# EAGLE design rat17-18 (EAGLE 8.3.2)
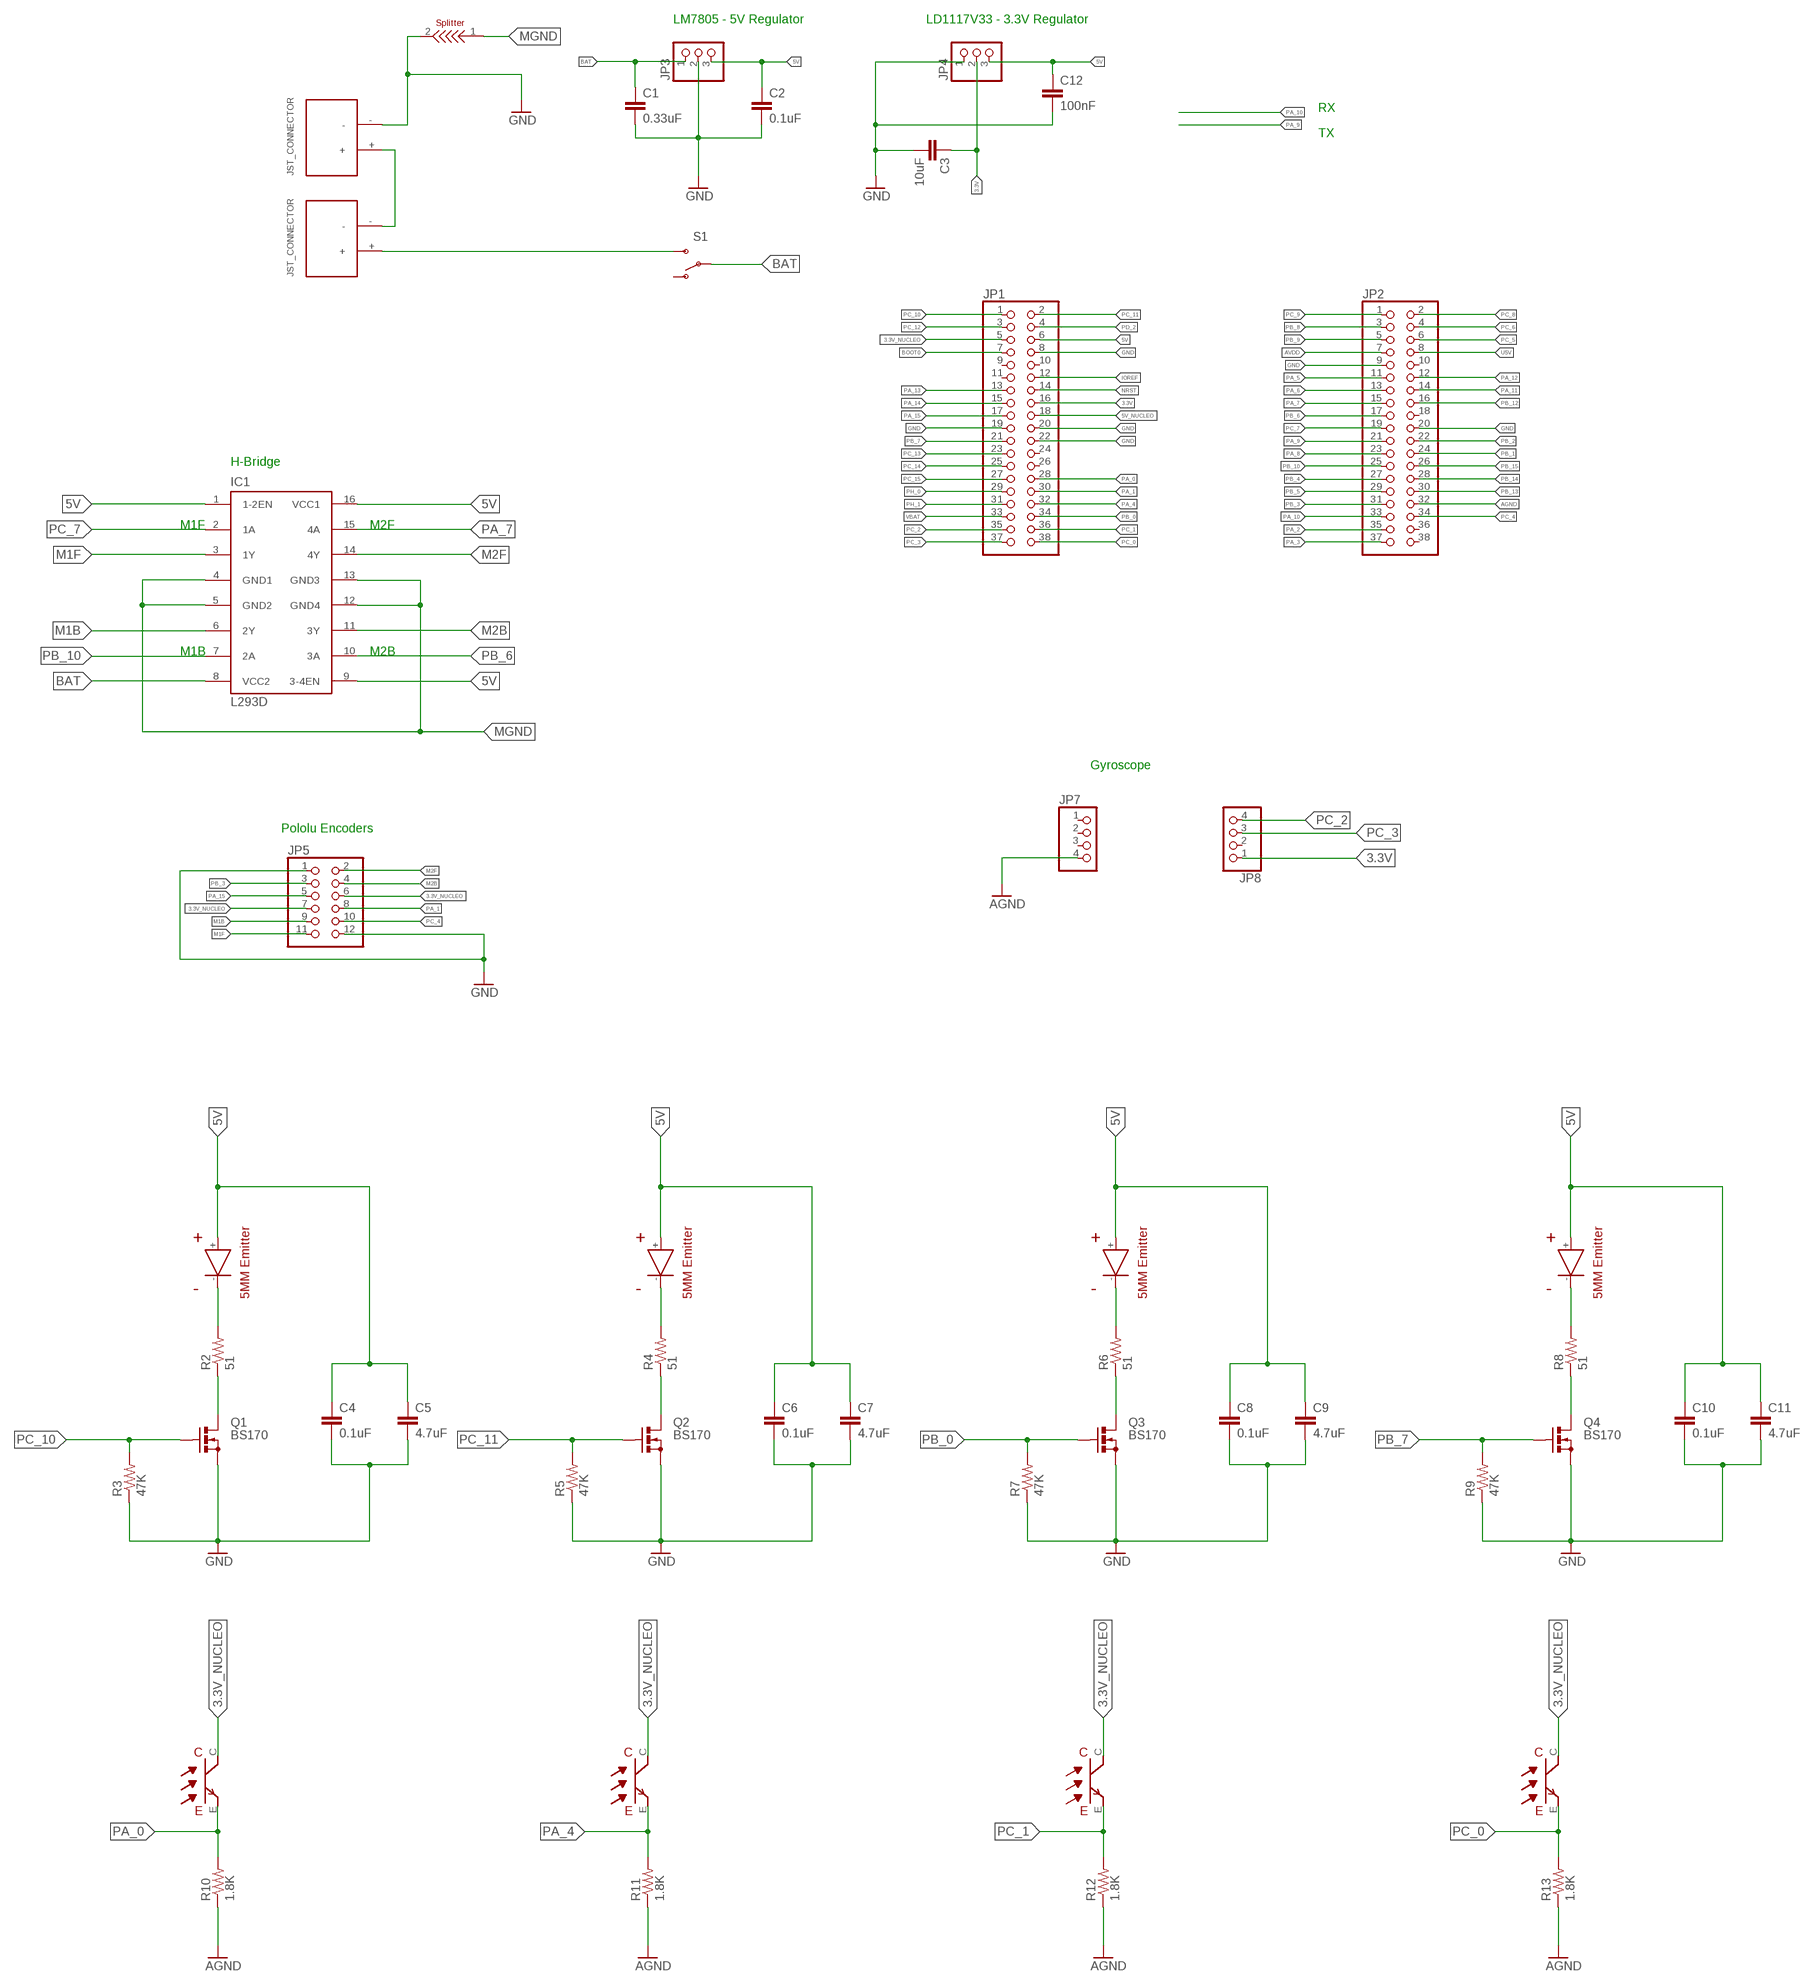
[diagram p0: schematic, sheet 1]

## Parts
C1  0.33uF  CAP_  [AXIAL-5MM]
C2  0.1uF  CAP_  [AXIAL-5MM]
C3  10uF  CAP_  [AXIAL-5MM]
C4  0.1uF  CAP_  [AXIAL-5MM]
C5  4.7uF  CAP_  [AXIAL-5MM]
C6  0.1uF  CAP_  [AXIAL-5MM]
C7  4.7uF  CAP_  [AXIAL-5MM]
C8  0.1uF  CAP_  [AXIAL-5MM]
C9  4.7uF  CAP_  [AXIAL-5MM]
C10  0.1uF  CAP_  [AXIAL-5MM]
C11  4.7uF  CAP_  [AXIAL-5MM]
C12  100nF  CAP_  [AXIAL-5MM]
IC1  L293D  [DIL16]
JP1  PINHD-2X19  [2X19]
JP2  PINHD-2X19  [2X19]
JP3  PINHD-1X3  [1X03]
JP4  PINHD-1X3  [1X03]
JP5  PINHD-2X6  [2X06]
JP7  PINHD-1X4  [1X04]
JP8  PINHD-1X4  [1X04]
Q1  BS170  [SOT54E]
Q2  BS170  [SOT54E]
Q3  BS170  [SOT54E]
Q4  BS170  [SOT54E]
R2  51  RESISTORAXIAL-0.3  [AXIAL-0.3]
R3  47K  RESISTORAXIAL-0.3  [AXIAL-0.3]
R4  51  RESISTORAXIAL-0.3  [AXIAL-0.3]
R5  47K  RESISTORAXIAL-0.3  [AXIAL-0.3]
R6  51  RESISTORAXIAL-0.3  [AXIAL-0.3]
R7  47K  RESISTORAXIAL-0.3  [AXIAL-0.3]
R8  51  RESISTORAXIAL-0.3  [AXIAL-0.3]
R9  47K  RESISTORAXIAL-0.3  [AXIAL-0.3]
R10  1.8K  RESISTORAXIAL-0.3  [AXIAL-0.3]
R11  1.8K  RESISTORAXIAL-0.3  [AXIAL-0.3]
R12  1.8K  RESISTORAXIAL-0.3  [AXIAL-0.3]
R13  1.8K  RESISTORAXIAL-0.3  [AXIAL-0.3]
S1  SWITCH-SPSTPTH  [SWITCH-SPDT]
U$1  JST_CONNECTOR_FEMALE  [JST_CONNECTOR_FEMALE]
U$2  JST_CONNECTOR_FEMALE  [JST_CONNECTOR_FEMALE]
U$3  SPLITTER  [SPLITTER]
U$4  RECEIVER  [RECEIVER]
U$5  EMITTER  [EMITTER]
U$6  EMITTER  [EMITTER]
U$7  EMITTER  [EMITTER]
U$8  EMITTER  [EMITTER]
U$15  RECEIVER  [RECEIVER]
U$18  RECEIVER  [RECEIVER]
U$19  RECEIVER  [RECEIVER]

## Nets
3.3V: C3.P$1 JP1.16 JP4.2 JP8.1
3.3V_NUCLEO: JP1.5 JP5.6 JP5.7 U$4.C U$15.C U$18.C U$19.C
5V: C2.P$1 C4.P$1 C5.P$1 C6.P$1 C7.P$1 C8.P$1 C9.P$1 C10.P$1 C11.P$1 C12.P$1 IC1.1(1-2EN) IC1.9(3-4EN) IC1.16(VCC1) JP1.6 JP3.3 JP4.3 U$5.+ U$6.+ U$7.+ U$8.+
5V_NUCLEO: JP1.18
AGND: JP2.32 JP7.4 R10.P$1 R11.P$1 R12.P$1 R13.P$1
AVDD: JP2.7
BAT: C1.P$1 IC1.8(VCC2) JP3.1 S1.2(P)
BOOT0: JP1.7
GND: C1.P$2 C2.P$2 C3.P$2 C4.P$2 C5.P$2 C6.P$2 C7.P$2 C8.P$2 C9.P$2 C10.P$2 C11.P$2 C12.P$2 JP1.8 JP1.19 JP1.20 JP1.22 JP2.9 JP2.20 JP3.2 JP4.1 JP5.1 JP5.12 Q1.S Q2.S Q3.S Q4.S R3.P$1 R5.P$1 R7.P$1 R9.P$1 U$1.- U$3.2
IOREF: JP1.12
M1B: IC1.6(2Y) JP5.9
M1F: IC1.3(1Y) JP5.11
M2B: IC1.11(3Y) JP5.4
M2F: IC1.14(4Y) JP5.2
MGND: IC1.4(GND1) IC1.5(GND2) IC1.12(GND4) IC1.13(GND3) U$3.1
N$1: U$1.+ U$2.-
N$2: R4.P$2 U$6.-
N$3: S1.3(S) U$2.+
N$6: R2.P$2 U$5.-
N$7: Q1.D R2.P$1
N$10: Q2.D R4.P$1
N$11: R6.P$2 U$7.-
N$12: Q3.D R6.P$1
N$13: R8.P$2 U$8.-
N$14: Q4.D R8.P$1
NRST: JP1.14
PA_0: JP1.28 R10.P$2 U$19.E
PA_1: JP1.30 JP5.8
PA_2: JP2.35
PA_3: JP2.37
PA_4: JP1.32 R11.P$2 U$18.E
PA_5: JP2.11
PA_6: JP2.13
PA_7: IC1.15(4A) JP2.15
PA_8: JP2.23
PA_9: JP2.21
PA_10: JP2.33
PA_11: JP2.14
PA_12: JP2.12
PA_13: JP1.13
PA_14: JP1.15
PA_15: JP1.17 JP5.5
PB_0: JP1.34 Q3.G R7.P$2
PB_1: JP2.24
PB_2: JP2.22
PB_3: JP2.31 JP5.3
PB_4: JP2.27
PB_5: JP2.29
PB_6: IC1.10(3A) JP2.17
PB_7: JP1.21 Q4.G R9.P$2
PB_8: JP2.3
PB_9: JP2.5
PB_10: IC1.7(2A) JP2.25
PB_12: JP2.16
PB_13: JP2.30
PB_14: JP2.28
PB_15: JP2.26
PC_0: JP1.38 R13.P$2 U$4.E
PC_1: JP1.36 R12.P$2 U$15.E
PC_2: JP1.35 JP8.4
PC_3: JP1.37 JP8.3
PC_4: JP2.34 JP5.10
PC_5: JP2.6
PC_6: JP2.4
PC_7: IC1.2(1A) JP2.19
PC_8: JP2.2
PC_9: JP2.1
PC_10: JP1.1 Q1.G R3.P$2
PC_11: JP1.2 Q2.G R5.P$2
PC_12: JP1.3
PC_13: JP1.23
PC_14: JP1.25
PC_15: JP1.27
PD_2: JP1.4
PH_0: JP1.29
PH_1: JP1.31
U5V: JP2.8
VBAT: JP1.33
Unconnected: JP1.9 JP1.10 JP1.11 JP1.24 JP1.26 JP2.10 JP2.18 JP2.36 JP2.38 JP7.1 JP7.2 JP7.3 JP8.2 S1.1(O)

## Notes on the sheet
- LM7805 - 5V Regulator | LD1117V33 - 3.3V Regulator
- RX
- TX
- H-Bridge
- M1F | M2F
- M1B | M2B
- Gyroscope
- Pololu Encoders

## Library data of the parts
C1-C12 = SparkFun:CAP: Capacitor Standard 0603 ceramic capacitor, and 0.1" leaded capacitor.
IC1 = st-microelectronics:L293D: PUSH-PULL 4 CHANNEL DRIVER; MPN: L293D; OC_FARNELL: 9589619; OC_NEWARK: 56P8249
JP1 JP2 = pinhead:PINHD-2X19: PIN HEADER
JP3 JP4 = pinhead:PINHD-1X3: PIN HEADER
JP5 = pinhead:PINHD-2X6: PIN HEADER
JP7 JP8 = pinhead:PINHD-1X4: PIN HEADER
Q1-Q4 = transistor-small-signal:BS170: N-CHANNEL MOS FET
R2-R13 = SparkFun-Passives:RESISTOR: Resistor Basic schematic elements and footprints for 0603, 1206, and PTH resistors.
S1 = SparkFun:SWITCH-SPST: SPST Switch Simple slide switch. Spark Fun Electronics SKU : COM-00102
U$1 U$2 = JST_CONNECTOR_FEMALE. through hole:JST_CONNECTOR_FEMALE
U$3 = splitter:SPLITTER
U$4 U$15 U$18 U$19 = sfh4550 _ teft4300:RECEIVER
U$5-U$8 = sfh4550 & teft4300:EMITTER

## Board
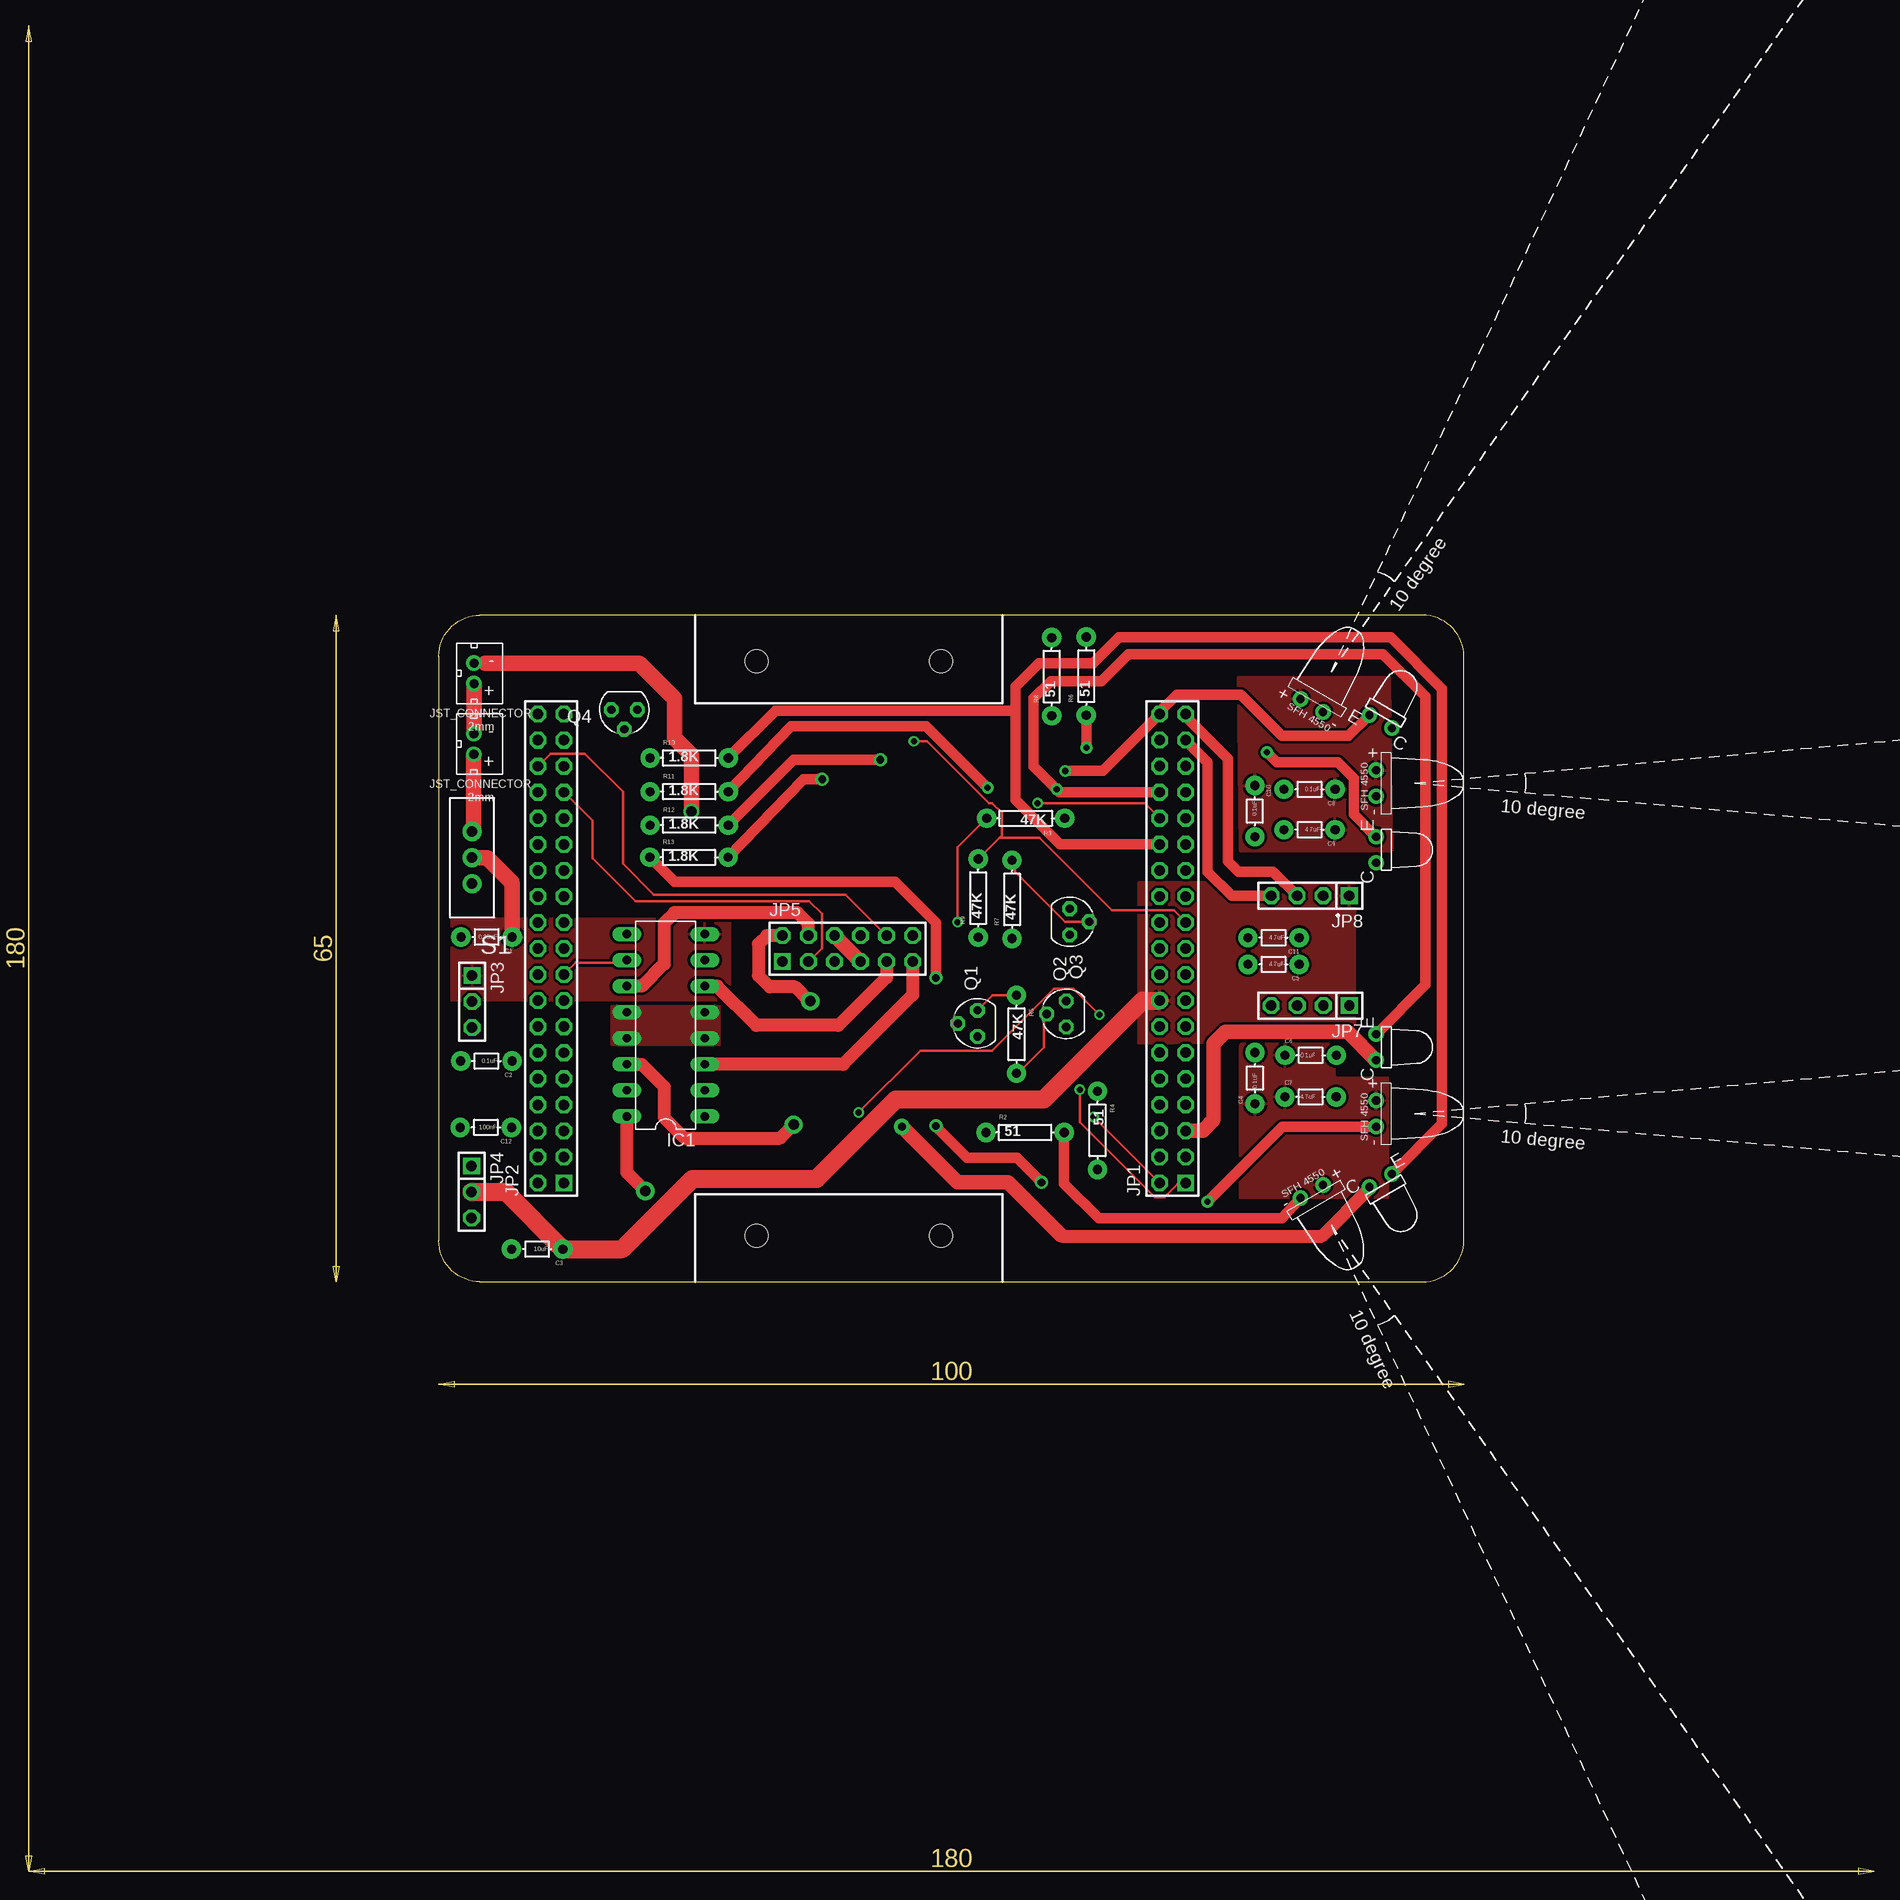
[diagram p1: board, top side]
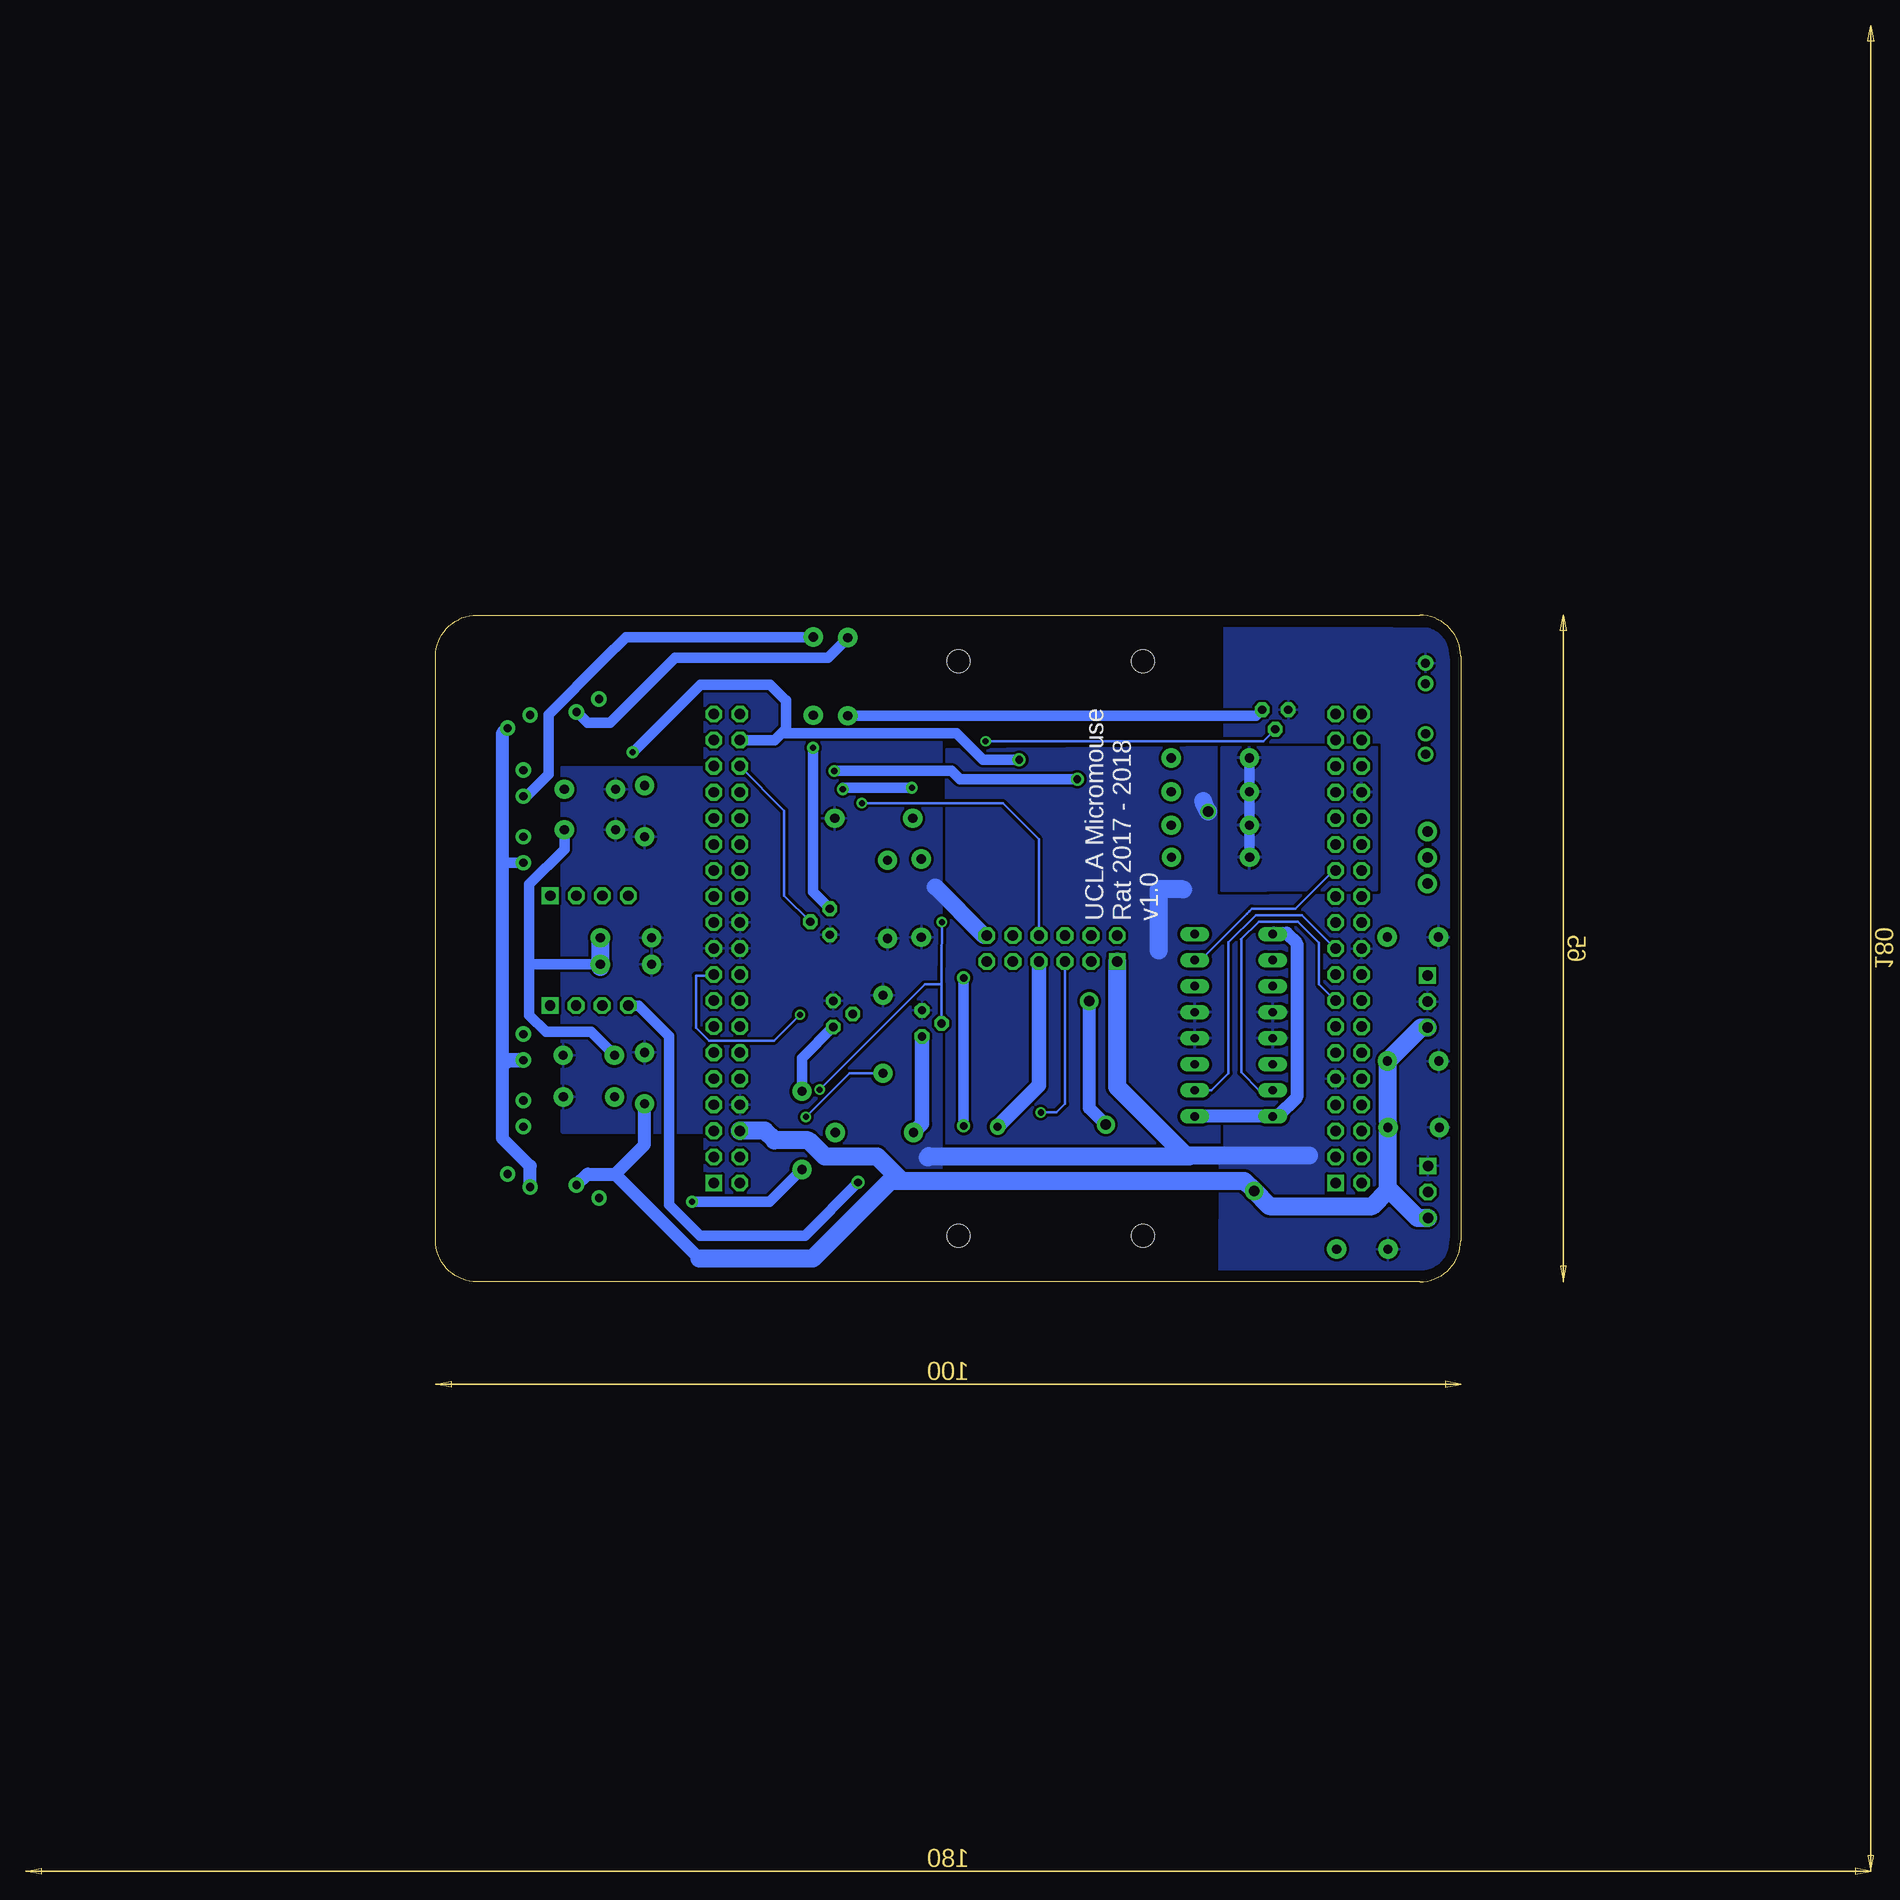
[diagram p2: board, bottom side, seen from below]

Size 100 x 65 mm. Coordinates in mm from the lower left corner, seen from the top.
Outline: 96,65 4,65 arc90 0,61 0,4 arc90 4,0 96,0 arc90 100,4 100,61 arc90 96,65
Copper layers (1*16): Top 0.035mm / dielectric 1.5mm / Bottom 0.035mm
Design rules "default *": minimum track width 10mil, minimum drill 24mil, track to track 10mil, track to pad 10mil, pad to pad 10mil, via to via 10mil, smd to smd 8mil, copper to edge 40mil, drill to drill 8mil, minimum pad ring 12mil, minimum via ring 8mil, stop-mask expansion 0mil, vias tented up to drill 12mil, thermal gap 10mil
Holes 2.25 mm at 31,4.5 49,4.5 31,60.5 49,60.5
bKeepout: area 25,0 to 55,8.5; area 25,56.5 to 55,65
tRestrict: area 25,0 to 55,8.5; area 25,56.5 to 55,65
bRestrict: area 25,0 to 55,8.5; area 25,56.5 to 55,65
vRestrict: area 25,0 to 55,8.5; area 25,56.5 to 55,65

### Footprints (pad centres in the part's own frame; a part is rotated, then mirrored left to right if it is on the bottom)
AXIAL-5MM = drill 0.9 pad 1.88: P$1 -2.5,0; P$2 2.5,0
DIL16 = drill 0.813 long: 1 -8.89,-3.81; 2 -6.35,-3.81; 3 -3.81,-3.81; 4 -1.27,-3.81; 5 1.27,-3.81; 6 3.81,-3.81; 7 6.35,-3.81; 8 8.89,-3.81; 9 8.89,3.81; 10 6.35,3.81; 11 3.81,3.81; 12 1.27,3.81; 13 -1.27,3.81; 14 -3.81,3.81; 15 -6.35,3.81; 16 -8.89,3.81
2X19 = drill 1.016 square: 1 -22.86,-1.27 | drill 1.016 octagon: 2 -22.86,1.27; 3 -20.32,-1.27; 4 -20.32,1.27; 5 -17.78,-1.27; 6 -17.78,1.27; 7 -15.24,-1.27; 8 -15.24,1.27; 9 -12.7,-1.27; 10 -12.7,1.27; 11 -10.16,-1.27; 12 -10.16,1.27; 13 -7.62,-1.27; 14 -7.62,1.27; 15 -5.08,-1.27; 16 -5.08,1.27; 17 -2.54,-1.27; 18 -2.54,1.27; 19 0,-1.27; 20 0,1.27; 21 2.54,-1.27; 22 2.54,1.27; 23 5.08,-1.27; 24 5.08,1.27; 25 7.62,-1.27; 26 7.62,1.27; 27 10.16,-1.27; 28 10.16,1.27; 29 12.7,-1.27; 30 12.7,1.27; 31 15.24,-1.27; 32 15.24,1.27; 33 17.78,-1.27; 34 17.78,1.27; 35 20.32,-1.27; 36 20.32,1.27; 37 22.86,-1.27; 38 22.86,1.27
1X03 = drill 1.016 square: 1 -2.54,0 | drill 1.016 octagon: 2 0,0; 3 2.54,0
2X06 = drill 1.016 square: 1 -6.35,-1.27 | drill 1.016 octagon: 2 -6.35,1.27; 3 -3.81,-1.27; 4 -3.81,1.27; 5 -1.27,-1.27; 6 -1.27,1.27; 7 1.27,-1.27; 8 1.27,1.27; 9 3.81,-1.27; 10 3.81,1.27; 11 6.35,-1.27; 12 6.35,1.27
1X04 = drill 1.016 square: 1 -3.81,0 | drill 1.016 octagon: 2 -1.27,0; 3 1.27,0; 4 3.81,0
SOT54E = drill 0.813 octagon: D -1.27,0; G 0,1.905; S 1.27,0
AXIAL-0.3 = drill 0.9 pad 1.88: P$1 -3.81,0; P$2 3.81,0
SWITCH-SPDT = drill 1.016 pad 1.88: 1 0,2.54; 2 0,0; 3 0,-2.54
JST_CONNECTOR_FEMALE = drill 0.889: + 0,1; - 0,-1
SPLITTER = smd 0.102 x 0.102: 1 0,0; 2 0,0
RECEIVER = drill 0.8 pad 1.5: C 1.27,-0.5; E -1.27,-0.5
EMITTER = drill 0.8 pad 1.5: + -1.27,-0.5; - 1.27,-0.5

### Placement (x,y rotation side)
C1  4.67,33.62 180 top
C2  4.65,21.51 180 top
C3  9.6,3.18 180 top
C4  79.62,19.85 90 top
C5  81.44,30.95 180 top
C6  85.06,22.08 0 top
C7  85.05,18.02 0 top
C8  84.94,48.02 180 top
C9  84.94,44.08 180 top
C10  79.61,45.89 270 top
C11  81.44,33.55 180 top
C12  4.6,15.05 180 top
IC1  22.14,25.02 90 top
JP1  71.59,32.5 90 top
JP2  10.95,32.49 90 top
JP3  3.25,27.32 270 top
JP4  3.2,8.76 270 top
JP5  39.88,32.48 0 top
JP7  85.03,26.92 180 top
JP8  85.02,37.64 180 top
Q1  52.55,25.2 90 top
Q2  61.21,26.11 90 top
Q3  61.54,35.1 270 top
Q4  18.1,55.78 180 top
R2  57.2,14.55 0 top
R3  57.26,45.19 180 top
R4  64.26,14.76 270 top
R5  56.36,24.13 270 top
R6  63.17,59.05 90 top
R7  55.93,37.29 90 top
R8  59.79,59 90 top
R9  52.62,37.41 90 top
R10  24.43,51.08 0 top
R11  24.43,47.79 0 top
R12  24.43,44.53 0 top
R13  24.41,41.39 0 top
S1  3.25,41.36 180 top
U$1  3.44,59.33 180 top
U$2  3.42,52.44 180 top
U$3  4.54,60.31 270 top
U$4  92.13,55.06 330 top
U$5  85.41,8.37 210 top
U$6  91.94,16.39 270 top
U$7  91.94,48.62 270 top
U$8  85.41,56.63 330 top
U$15  91.94,42.12 270 top
U$18  91.94,22.88 270 top
U$19  92.13,9.43 210 top

### Tracks (layer width: path | path; a pad name or v marks a point on that pad's centre or on a via)
3.3V
  Top 1.778: JP1.16 68.67,27.42 59.03,17.78 44.6,17.78 36.85,10.03 24.75,10.03 17.89,3.18 C3.P$1 6.52,8.76 JP4.2
  pour Top (rank 2): 89.35,38.9 68.27,38.9 68.27,23.24 85.49,23.49 89.35,24.23
3.3V_NUCLEO  (via drill 0.76 pad 1.52)
  Top 1.27: U$19.C 90.78,9.09 86.13,4.45 60.78,4.45 60.71,4.52
  Top 1.422: 60.71,4.52 55.52,9.7 50.6,9.7 v45.19,15.11 | JP1.5 74.53,14.72 75.59,15.77 75.59,23.22 76.73,24.36 88.68,24.36 | JP5.6 JP5.7
  Top 1.424: 88.68,24.36 U$18.C
  Bottom 1.016: 93.38,40.88 93.36,40.85 U$15.C
  Bottom 1.27: 93.5,41 93.5,21 | 93.5,41 93.5,53.49 93,53.99 U$4.C | 93.5,21 93.5,14 90.78,11.28 U$19.C | 93.5,21 92.9,21.6 | 93.5,41 93.38,40.88
  Bottom 1.422: JP5.7 41.15,19.15 v45.19,15.11
  Bottom 1.424: 92.9,21.6 92.89,21.61 U$18.C
5V  (via drill 1.02 pad 1.78)
  Top 1.27: IC1.16 18.34,10.66 v20.15,8.85
  Bottom 1.016: C9.P$1 87.44,42.18 90.88,38.75 90.88,31 | C6.P$1 84.85,24.38 89.25,24.38 90.88,26 90.88,31 | C5.P$1 90.82,30.95 90.88,31
  Bottom 1.27: U$5.+ 85.17,10.5 82.5,10.5 | 82.5,10.5 74.29,2.29 | 82.5,10.5 79.62,13.38 C4.P$1 | IC1.9 18.24,34 17,34 16,33 16,18 17.87,16.13 IC1.16 IC1.1
  Bottom 1.422: 83.94,30.7 C5.P$1
  Bottom 1.778: 54.53,9.83 55.65,9.83 63.2,2.29 74.29,2.29 | 54.53,9.83 21.13,9.83 v20.15,8.85 18.67,7.37 8.64,7.37 7.1,8.9 7.1,9.1 | C11.P$1 83.94,30.7 C5.P$1 | 54.53,9.83 56.92,12.22 62.05,12.22 63.63,13.79 66.95,13.79 67.89,14.73 70.31,14.73 JP1.6 | JP3.3 3.88,24.78 C2.P$1 7.15,16.1 C12.P$1 | 7.05,15 C12.P$1 | 7.1,9.1 C12.P$1 | JP4.3 4.22,6.22 7.1,9.1
  pour Top: 92.61,19.89 92.61,8.17 78.18,8.17 78.18,22.96 arc-90 78.44,23.22 87.38,23.22 87.38,20.14 arc90 87.63,19.89
  pour Top: 92.77,58.92 77.97,58.92 78.18,42.01 92.97,42
AGND  (via drill 0.76 pad 1.27)
  Top 1.016: v48.49,15.19 48.49,15.11 51.54,12.06 56.41,12.06 v58.8,9.68 | v48.49,29.62 48.49,35 44.49,39 23,39 20.6,41.4 R13.P$1
  Bottom 1.016: R10.P$1 R11.P$1 R12.P$1 R13.P$1 | v48.49,15.19 v48.49,29.62 | v58.8,9.68 63.98,4.5 74.21,4.5 77.22,7.5 77.22,23.92 80.22,26.92 JP7.4
  pour Bottom: 23.28,52.15 8.23,52.15 8.26,38.17 18.97,38.15 23.28,38.09
BAT
  Top 1.524: S1.2 4.74,41.36 7.17,38.93 C1.P$1
  pour Top: 1.17,35.39 28.4,35.39 28.4,27.45 0.94,27.45
GND
  Top 0.254: R5.P$1 54.03,27.94 Q1.S
  Top 0.406: U$1.- 4.53,60.33 U$3.2
  Bottom 0.254: 32.98,18.45 33.02,18.41 33.53,19.02 | 27.58,13.06 27.62,13.02 27.62,12.24
  Bottom 1.676: JP5.12 46.51,33.76 51.25,38.5
  Bottom 1.778: JP5.1 33.53,19.02 | 26.82,12.32 26.26,12.32 | 26.26,12.32 14.81,12.32 | 33.53,19 32.98,18.45 27.58,13.06 26.77,12.24 | 52.02,12.12 51.89,12.24 27.62,12.24 26.34,12.24 26.26,12.32
  pour Bottom: 52.7,1.7 73.51,1.7 arc90 73.76,1.96 73.76,14.5 87.48,14.5 arc90 87.73,14.76 87.73,50.16 74.02,50.16 arc-90 73.76,50.42 73.76,58.52 50.9,58.52 arc90 50.65,58.27 50.65,3 50.65,1.96 arc90 50.9,1.7
  pour Bottom (rank 2): 1.09,63.68 23.03,63.85 23.03,12.95 23.42,12.17 arc-90 23.5,11.38 23.55,0.94 2.16,1.14 arc-90 0.56,3.89
M1B
  Top 1.27: JP5.9 43.69,29.69 39,25 31,25 27.17,28.83 IC1.6
M1F
  Top 1.27: JP5.11 46.23,27.98 39.46,21.21 IC1.3
M2B
  Top 1.27: JP5.4 36.07,34.93 35,36 23,36 22,35 22,31 19.83,28.83 IC1.11
M2F  (via drill 1.02 pad 1.78)
  Top 1.27: v36.25,27.36 36.14,27.36 34.75,28.75 32.29,28.75 31.19,29.84 31.19,32.94 32.01,33.76 JP5.2 | IC1.14 19.79,21.21 22,19 22,16 24,14 33.3,14 v34.62,15.32
  Bottom 1.27: v36.25,27.36 36.25,16.94 v34.62,15.32
MGND  (via drill 1 pad 1.02)
  Top 1.524: v24.64,45.86 24.64,51.36 23,53 23,56.83 19.52,60.31 U$3.1
  Bottom 1.778: v24.64,45.86 25.15,46.86 | 27.08,38.25 29.49,38.25 29.49,32.31
  pour Bottom (rank 3): 15.14,10.54 50.16,10.29 50.16,51.94 15.14,52.2
  pour Top (no thermals): 16.88,26.88 16.88,23.12 27.38,23.12 27.38,26.88
N$1
  Top 1.524: U$1.+ 3.44,53.45 U$2.-
N$2  (via drill 0.61 pad 1.14)
  Top 1.016: v74.98,7.8 82.31,15.12 U$6.-
  Bottom 1.016: R4.P$2 67.41,7.8 v74.98,7.8
N$3
  Top 1.524: U$2.+ 3.42,44.07 S1.3
N$6
  Top 1.016: R2.P$2 61.01,9.58 64.41,6.17 71.04,6.2 82.23,6.2 U$5.-
N$7
  Bottom 1.422: R2.P$1 52.55,15.39 Q1.D
N$10
  Bottom 1.016: R4.P$1 64.26,21.79 Q2.D
N$11
  Bottom 1.016: 83.84,60.45 83.65,60.65 | 83.65,60.65 81.43,62.87 R6.P$2 | 83.65,60.65 89,55.3 89,49.5 91.15,47.35 U$7.-
N$12  (via drill 0.61 pad 1.14)
  Top 1.016: R6.P$1 63.17,52.09 v63.2,52.07
  Bottom 1.016: Q3.D 63.2,38.02 v63.2,52.07
N$13
  Bottom 1.016: R8.P$2 61.75,60.86 76.64,60.86 83,54.5 85.2,54.5 U$8.-
N$14
  Bottom 1.016: 25.15,55.19 R8.P$1 | 25.15,55.19 24.56,55.19 | Q4.D 19.96,55.19 25.15,55.19
PA_0
  Top 1.016: 56.29,55.68 56.29,58.04 58.55,60.3 63.83,60.3 66.37,62.84 92.86,62.84 97.87,57.84 97.87,15.39 U$19.E | 56.29,55.68 56.29,46.99 60.62,42.66 JP1.28 | R10.P$2 32.84,55.68 56.29,55.68
PA_1  (via drill 0.61)
  Top 0.254: v58.42,46.67 68.9,46.67 70.17,45.4 JP1.30
  Bottom 0.254: JP5.8 41.15,43.15 44.67,46.67 v58.42,46.67
PA_4  (via drill 0.61 pad 1.14)
  Top 1.016: v60.27,48.03 58.04,50.27 58.04,56.9 59.72,58.57 64.64,58.57 67.28,61.21 92.13,61.21 96.24,57.1 96.24,28.94 U$18.E | v60.27,48.03 60.38,47.93 | 60.38,47.93 60.57,47.74 JP1.32 | v60.27,48.03 60.38,48.03 60.38,47.93 | v53.54,48.18 47.55,54.18 34.38,54.18 R11.P$2 28.54,48.04
  Bottom 1.016: v53.54,48.18 60.27,48.18 v60.27,48.03
PA_7
  Bottom 0.254: JP2.15 13.82,29.01 13.82,33.07 15.88,35.13 19.71,35.13 21.44,33.4 21.41,33.38 21.41,20.41 19.67,18.67 IC1.15
PA_15  (via drill 0.61)
  Top 0.254: v40.96,16.51 46.99,22.54 53.98,22.54 60.01,28.57 61.91,28.57 v64.45,26.04
  Bottom 0.254: v64.45,26.04 66.99,23.5 73.34,23.5 74.61,24.77 74.61,29.84 73.03,29.84 JP1.17 | v40.96,16.51 39.45,16.51 38.61,17.35 JP5.5
PB_0
  Top 0.254: R7.P$2 56.2,40.96 56.2,40.01 61.1,35.1 Q3.G
  Bottom 0.254: JP1.34 66,45.95 66,37.65 Q3.G
PB_3
  Top 0.254: JP2.31 15,44.95 15,41.31 19.19,37.12 36.12,37.12 37.38,35.88 37.38,32.52 JP5.3
PB_6
  Top 0.254: IC1.10 18.1,31.11 13.34,31.11 12.38,30.16 JP2.17
PB_7  (via drill 0.61)
  Top 0.254: v46.35,52.7 47.62,52.7 53.66,46.67 53.98,46.67 54.93,45.72 54.93,43.53 54.7,43.3 | JP1.21 72.71,35.24 71.7,36.25 65.67,36.25 58.62,43.3 54.7,43.3 | 54.7,43.3 R9.P$2
  Bottom 0.254: 22.89,52.7 22.52,52.7 | 22.89,52.7 v46.35,52.7 | Q4.G 19.27,52.7 22.89,52.7
PB_10
  Bottom 0.254: JP2.25 12.39,40.11 16.13,36.38 20.38,36.38 20.88,35.88 | IC1.7 25.38,31.37 20.88,35.88 | 20.88,35.88 20.62,36.12
PC_0  (via drill 0.61 pad 1.14, 0.76 pad 1.27)
  Top 1.016: v61.11,49.81 64.81,49.81 64.81,49.84 JP1.38 70.32,55.57 72,57.25 78.25,57.25 82.25,53.25 88.75,53.25 90.76,55.26 U$4.E | R13.P$2 35.58,49 v37.41,49
  Bottom 1.016: 61.09,49.84 v61.11,49.81 49.66,49.81 48.84,49 v37.41,49
PC_1  (via drill 0.61 pad 1.14, 0.76 pad 1.27)
  Top 1.016: v80.8,51.64 81.76,50.67 87.71,50.67 89.28,49.1 89.28,45.57 91.44,43.41 U$15.E | R12.P$2 34.62,50.9 v43.08,50.9
  Bottom 1.016: 66.27,53.49 65.84,53.92 65.84,56.67 arc-90 65.86,56.69 67.39,58.22 74.17,58.22 80.75,51.64 v80.8,51.64 | 66.27,53.49 66.94,52.82 JP1.36 | 66.27,53.49 49.17,53.49 46.58,50.9 v43.08,50.9
PC_2
  Top 1.016: JP1.35 75,50.68 75,40 77.36,37.64 JP8.4
PC_3
  Top 1.016: JP1.37 72.86,55.14 77,51 77,41 78,40 81.39,40 JP8.3
PC_4
  Top 0.254: JP2.34 10.92,51.51 14.22,51.51 17.97,47.77 17.97,40.76 20.98,37.75 39.69,37.75 JP5.10
PC_7
  Bottom 0.254: JP2.19 15.48,35.75 20,35.75 22.66,33.09 22.66,20.34 24.33,18.67 IC1.2
PC_10  (via drill 0.61)
  Top 0.254: R3.P$2 53.34,45.09 50.62,42.36 v50.62,35.07 | v62.55,18.73 62.55,15.56 69.85,8.26 70.8,8.26 72.07,9.53 72.71,9.53 JP1.1
  Bottom 0.254: 50.8,25.4 Q1.G 50.65,29 | v62.55,18.73 52.28,29 50.65,29 | v50.62,35.07 50.65,30.79 50.65,29
PC_11  (via drill 0.61 pad 1.02)
  Top 0.254: Q2.G 59.05,26.04 59.05,22.86 56.52,20.32 R5.P$2 | JP1.2 v63.88,16.08
  Bottom 0.254: v63.88,16.08 59.64,20.32 R5.P$2

### Text on the board
bPlace: UCLA Micromouse / Rat 2017 - 2018 / v1.0